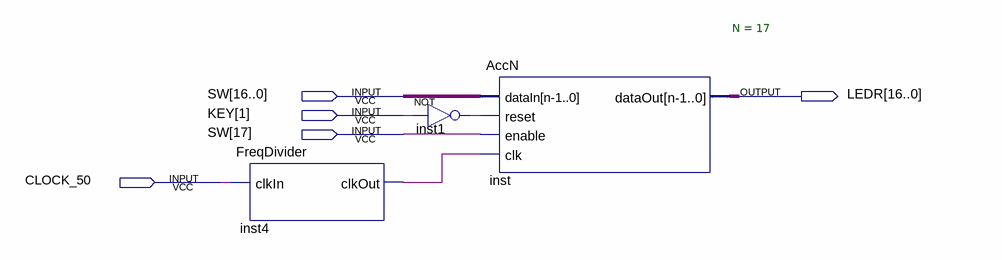
[diagram p0: schematic sheet]
// Quartus schematic AccN_Demo.bdf as structural Verilog: 3 symbols, 5 pins
module AccN_Demo (
  input  [17:0] SW,
  input  [1:1] KEY,
  input  CLOCK_50,
  output [16:0] LEDR
);

  wire inst1_out, inst4_clkout;

  FreqDivider inst4 (.clkIn(CLOCK_50), .clkOut(inst4_clkout));
  not inst1 (inst1_out, KEY[1]);
  AccN #(.N(17)) inst (.dataIn(SW[16:0]), .reset(inst1_out), .enable(SW[17]), .clk(inst4_clkout), .dataOut(LEDR));
endmodule
